# Altium schematic sheet AVMC - Shematic.SchDoc
size 431 x 279 mm; SheetNumber: 1; SheetTotal: 1
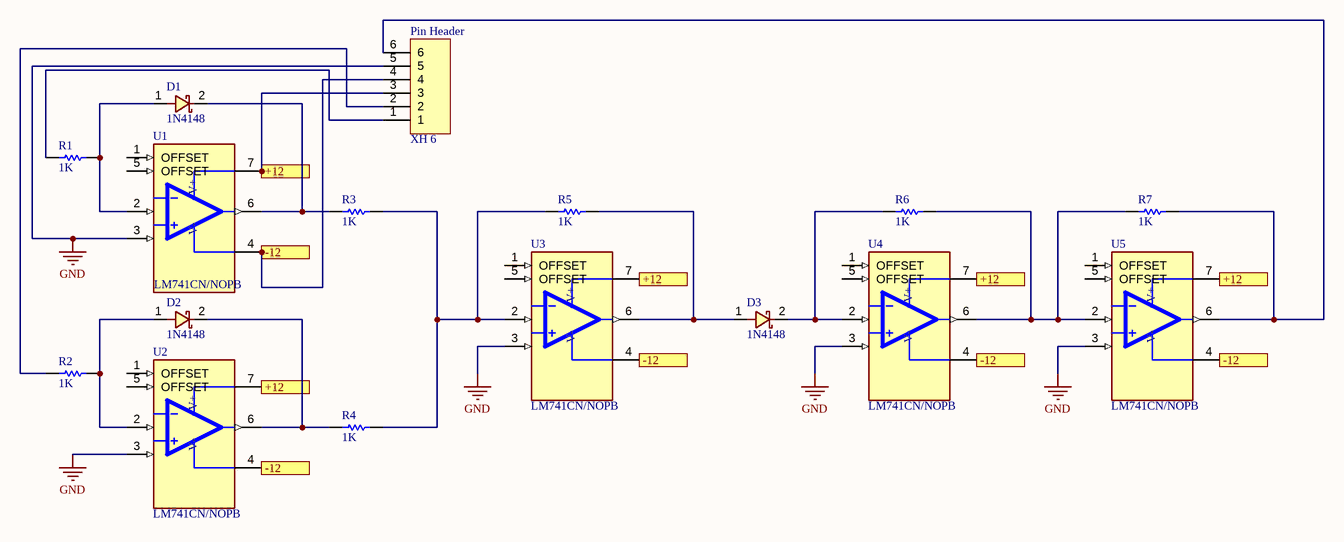
[diagram p0: AVMC - Shematic.SchDoc]

## Parts
D1  value 1N4148  [DO-35-]  (hidden comment: 1N4148 THD)
D2  value 1N4148  [DO-35-]  (hidden comment: 1N4148 THD)
D3  value 1N4148  [DO-35-]  (hidden comment: 1N4148 THD)
Pin_Header  XH 6  [XH 6 PIN]
R1  value 1K  [R1W_AX06]  (hidden comment: Resistor THD)
R2  value 1K  [R1W_AX06]  (hidden comment: Resistor THD)
R3  value 1K  [R1W_AX06]  (hidden comment: Resistor THD)
R4  value 1K  [R1W_AX06]  (hidden comment: Resistor THD)
R5  value 1K  [R1W_AX06]  (hidden comment: Resistor THD)
R6  value 1K  [R1W_AX06]  (hidden comment: Resistor THD)
R7  value 1K  [R1W_AX06]  (hidden comment: Resistor THD)
U1  LM741CN/NOPB  [DIP794W45P254L1016H508Q8]
U2  LM741CN/NOPB  [DIP794W45P254L1016H508Q8]
U3  LM741CN/NOPB  [DIP794W45P254L1016H508Q8]
U4  LM741CN/NOPB  [DIP794W45P254L1016H508Q8]
U5  LM741CN/NOPB  [DIP794W45P254L1016H508Q8]

## Ports
+12 (see Shematic[4B], Shematic[5B], Shematic[6B], Shematic[7B]), +12 (see Shematic[4B], Shematic[5B], Shematic[7B]), +12 (see Shematic[4B], Shematic[6B], Shematic[7B]), +12 (see Shematic[5B], Shematic[6B], Shematic[7B]), -12 (see Shematic[4B], Shematic[5B], Shematic[6B], Shematic[7A]), -12 (see Shematic[4B], Shematic[5B], Shematic[6B], Shematic[7B]), -12 (see Shematic[4B], Shematic[5B], Shematic[7A], Shematic[7B]), -12 (see Shematic[4B], Shematic[6B], Shematic[7A], Shematic[7B]), -12 (see Shematic[5B], Shematic[6B], Shematic[7A], Shematic[7B])

## Nets
GND: Pin_Header.5 U1.3(NON-INV_INPUT) U2.3(NON-INV_INPUT) U3.3(NON-INV_INPUT) U4.3(NON-INV_INPUT) U5.3(NON-INV_INPUT)
+12: Pin_Header.3 U1.7(V+) U2.7(V+) U3.7(V+) U4.7(V+) U5.7(V+) ; port +12
-12: Pin_Header.4 U1.4(V-) U2.4(V-) U3.4(V-) U4.4(V-) U5.4(V-) ; port -12
NetD1_1: D1.1 R1.2 U1.2(INV_INPUT)
NetD1_2: D1.2 R3.1 U1.6(OUTPUT)
NetD2_1: D2.1 R2.2 U2.2(INV_INPUT)
NetD2_2: D2.2 R4.1 U2.6(OUTPUT)
NetD3_1: D3.1 R5.2 U3.6(OUTPUT)
NetD3_2: D3.2 R6.1 U4.2(INV_INPUT)
NetPin_Header_1: Pin_Header.1 R1.1
NetPin_Header_2: Pin_Header.2 R2.1
NetPin_Header_6: Pin_Header.6 R7.2 U5.6(OUTPUT)
NetR3_2: R3.2 R4.2 R5.1 U3.2(INV_INPUT)
NetR6_2: R6.2 R7.1 U4.6(OUTPUT) U5.2(INV_INPUT)

Not connected (* = marked no-connect by the designer): U1 1(OFFSET) 5(OFFSET); U2 1(OFFSET) 5(OFFSET); U3 1(OFFSET) 5(OFFSET); U4 1(OFFSET) 5(OFFSET); U5 1(OFFSET) 5(OFFSET)

## Notes on the sheet
- DWG. NO.
- REV.
- SHT.
- THIS DOCUMENT AND THE DATA DISCLOSED HEREIN OR HEREWITH IS THE PROPERTY OF ALTIUM LIMITED AND MAY BE FREELY DISTRIBUTED IN WHOLE. NO RIGHTS ARE RESERVED OR EXPRESS OR IMPLIED WARANTEE GIVEN.
- REVISION
- DESCRIPTION
- DATE
- APPROVED
- ENG:
- APPROVALS
- PROJECT
- DSN:
- CHK:
- REFERENCE DOCUMENTS
- PROJECT REVISION:
- TITLE
- DOCUMENT REVISION:
- DESIGN ITEM:
- BOM:
- FAB DWG:
- PCB DWG:
- ASSY DWG:
- SCALE:
- SIZE
- B
- CAGE CODE
- FILE NAME
- DWG NO.
- SHEET
- OF
- REV

## Library data of the parts
D1-D3 = 1N4148 THD: High Conductance Fast Diode; DatasheetVersion: 2022; ComponentLink1Description: Tarahiboard; ComponentLink1URL: https://www.tarahiboard.com/product/library-pack
Pin_Header = Conector XH 6 Pin: ComponentLink1Description: Tarahiboard; ComponentLink1URL: https://www.tarahiboard.com/product/library-pack; DatasheetVersion: 2022
U1-U5 = LM741CN/NOPB: Ù…Ø¯Ø§Ø± ÛŒÚ©Ù¾Ø§Ø±Ú†Ù‡ Ø¢Ù…Ù¾Ø± Ø¹Ù…Ù„ÛŒØ§ØªÛŒ ØªÚ© Ù…Ù†Ø¸ÙˆØ±Ù‡ Ø¹Ù…ÙˆÙ…ÛŒ Ø´ÛŒØ¨ 8 Ø³Ø±Ø¨; MF: Texas; SnapEDA_Link: https://www.snapeda.com/parts/LM741CN/Texas+Instruments/view-part/?ref=snap; Package: PDIP-8 Texas; Value: *; MP: LM741CN; Check_prices: https://www.snapeda.com/parts/LM741CN/Texas+Instruments/view-part/?ref=eda
R1-R7 = Resistor THD: DatasheetVersion: 2022; ComponentLink1Description: Website: Tarahiboard; ComponentLink1URL: https://www.tarahiboard.com/product/library-pack